# Altium schematic sheet P03 Power Tree.SchDoc
size 297 x 209 mm
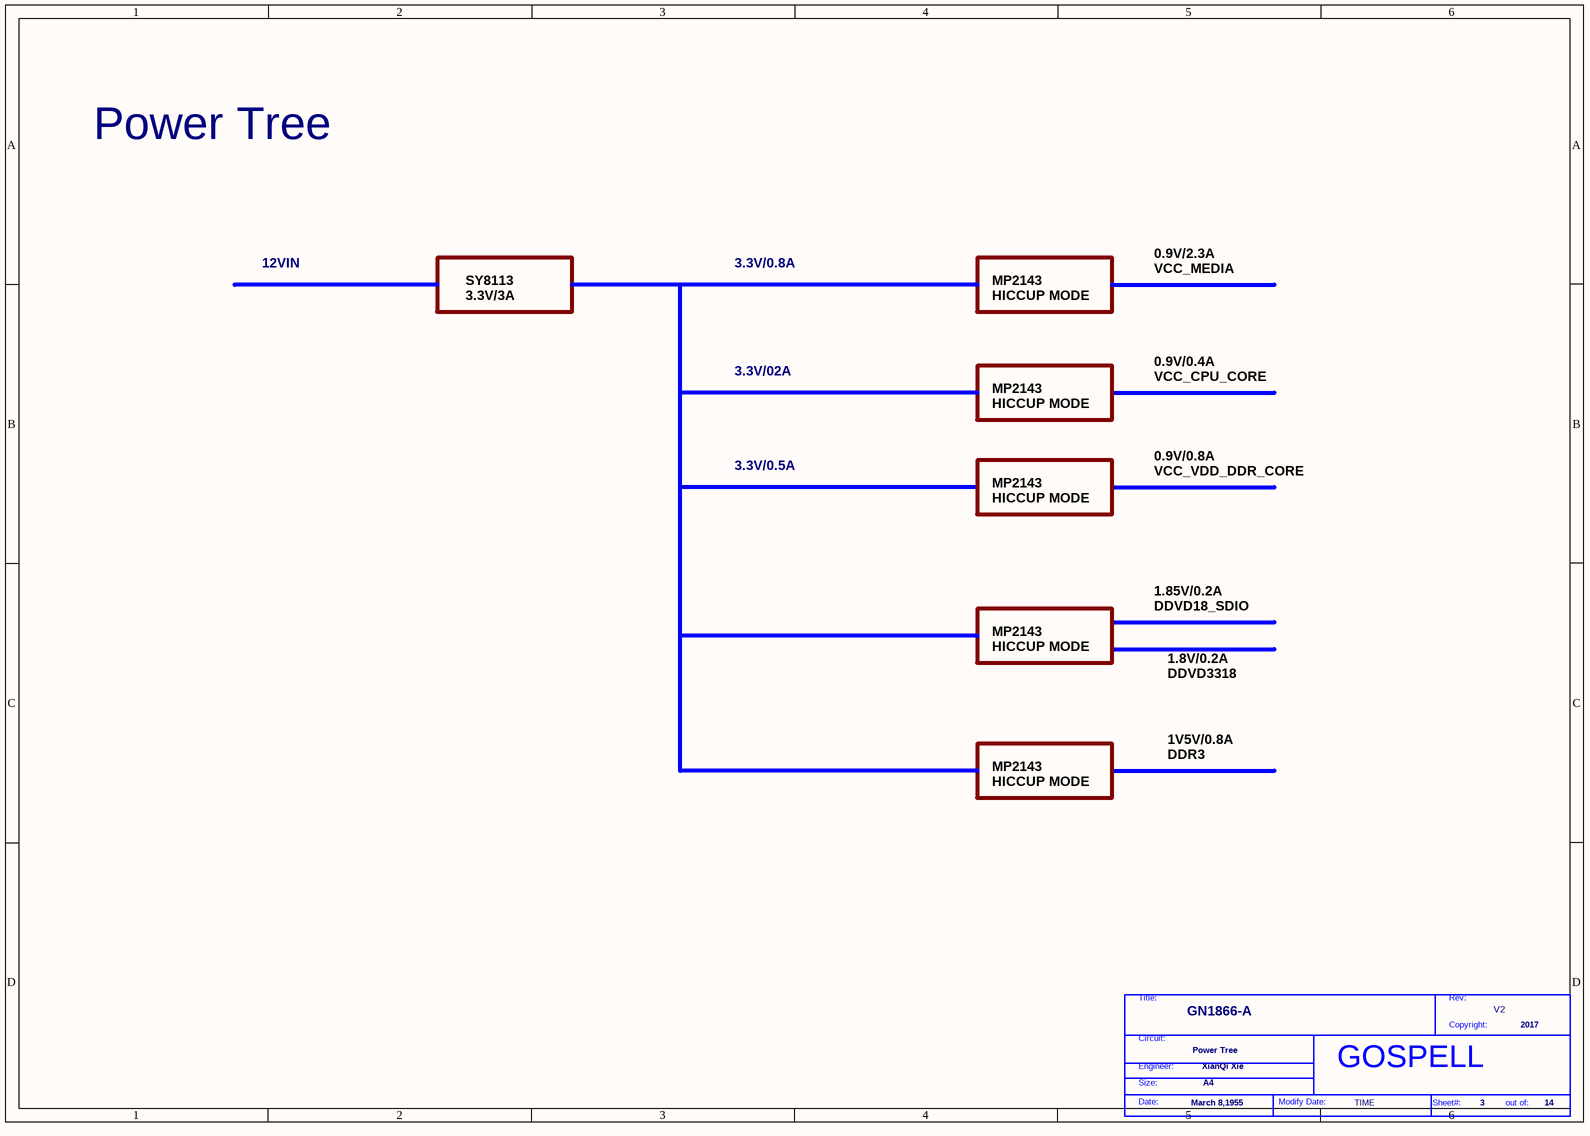
[diagram p0: P03 Power Tree.SchDoc]

## Parts
*  Page Modify Date: TIME  Engineer: XianQi Xie  Copyright: 2017  Title: GN1866-A  RevCode: V2  Page Size: A4  Page Create Date: March 8,1955  Page Number: 3  Page Count: 14  Doc: Power Tree  (hidden comment: GOSPELL)  (graphical)

## Notes on the sheet
- Power Tree
- 12VIN
- SY8113
  3.3V/3A
- 3.3V/0.8A
- MP2143
  HICCUP MODE
- 0.9V/2.3A
  VCC_MEDIA
- 3.3V/02A
- 0.9V/0.4A
  VCC_CPU_CORE
- 3.3V/0.5A
- 0.9V/0.8A
  VCC_VDD_DDR_CORE
- 1.85V/0.2A
  DDVD18_SDIO
- 1.8V/0.2A
  DDVD3318
- 1V5V/0.8A
  DDR3
- (in symbol GOSPELL) Title:; Rev:; Copyright:; Circuit:; Engineer:; Size:; Date:; Modify Date:; Sheet#:; out of:

## Library data of the parts
* = GOSPELL: Cage Code: 2017